# Altium schematic sheet Board.SchDoc
size 431 x 279 mm; Organization: Machine Intelligence Laboratory; Address1: 1889 Museum Rd; Address2: Room 3001; Address3: Gainesville, FL, 32611; SheetNumber: 1; SheetTotal: 1
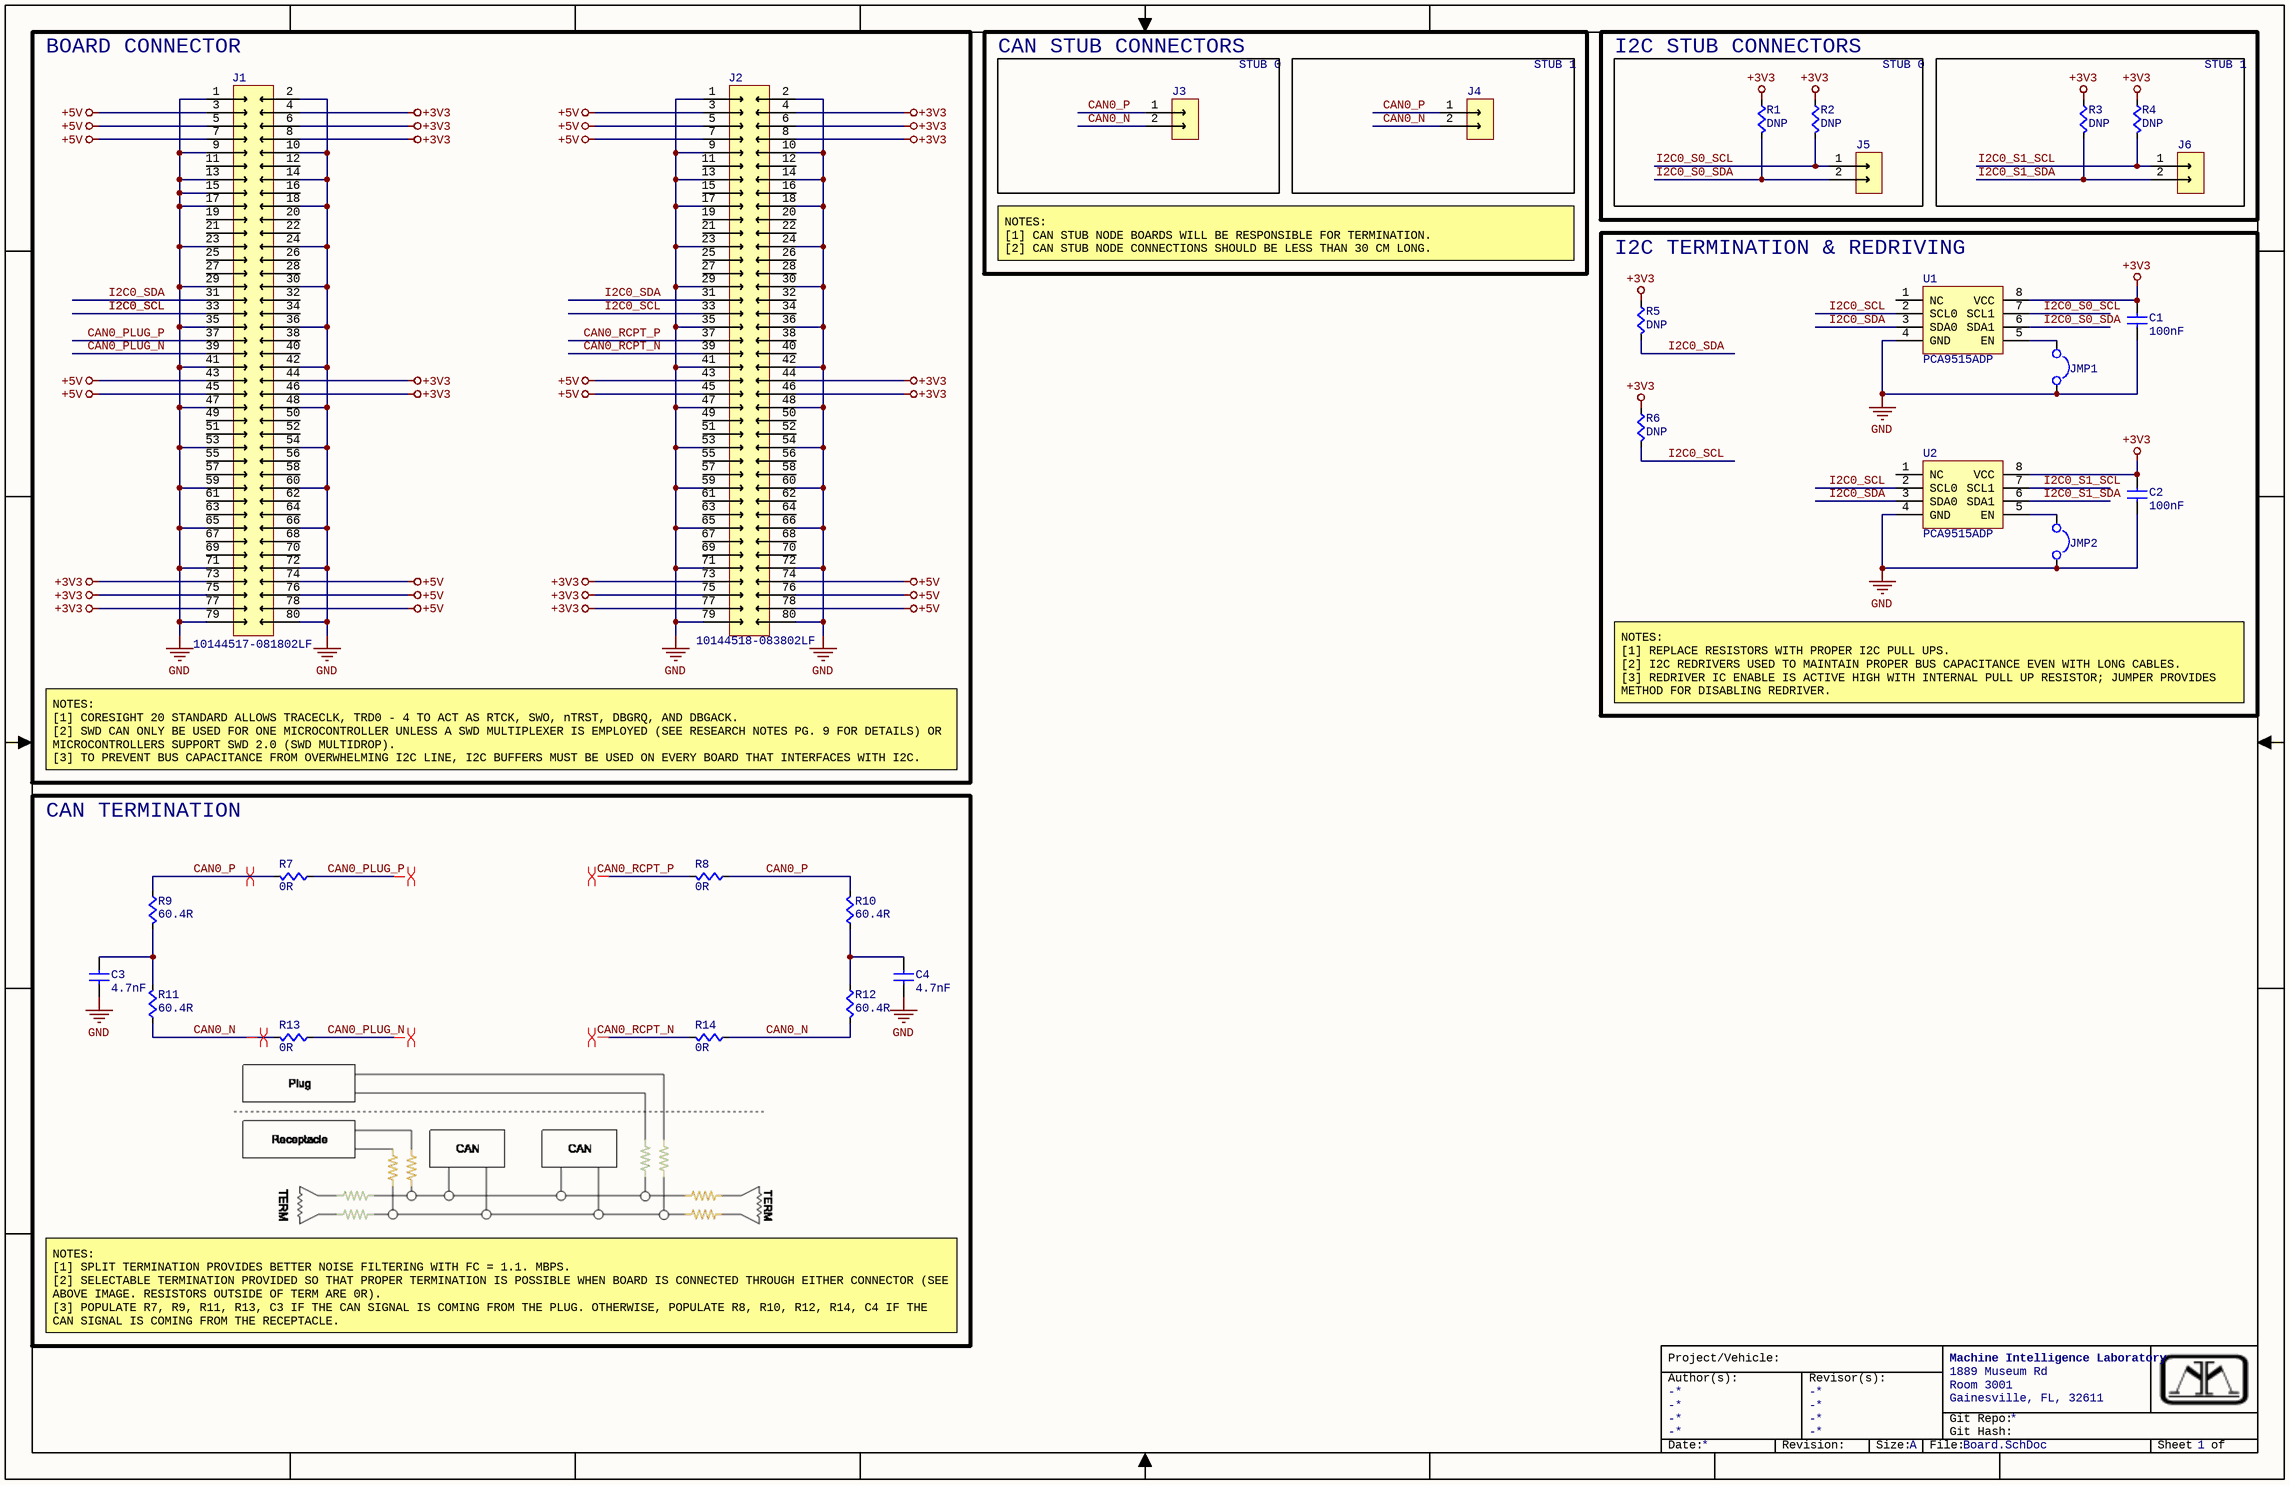
[diagram p0: Board.SchDoc]

## Parts
C1  100nF  [CAPC0603]
C2  100nF  [CAPC0603]
C3  4.7nF  [CAPC0603]
C4  4.7nF  [CAPC0603]
J1  10144517-081802LF  [AMPHENOL_10144517-081802LF]
J2  10144518-083802LF  [AMPHENOL_10144518-083802LF]
J3  0353630260  [MOLEX-HDR-1X2-SHERLOCK-HORZ]  (value not drawn)
J4  0353630260  [MOLEX-HDR-1X2-SHERLOCK-HORZ]  (value not drawn)
J5  0353630260  [MOLEX-HDR-1X2-SHERLOCK-HORZ]  (value not drawn)
J6  0353630260  [MOLEX-HDR-1X2-SHERLOCK-HORZ]  (value not drawn)
JMP1  2 Pin Header  [2PinJumper]  (value not drawn)  (no BOM)
JMP2  2 Pin Header  [2PinJumper]  (value not drawn)  (no BOM)
R1  DNP  [RES0603]
R2  DNP  [RES0603]
R3  DNP  [RES0603]
R4  DNP  [RES0603]
R5  DNP  [RES0603]
R6  DNP  [RES0603]
R7  0R  [RES0603]
R8  0R  [RES0603]
R9  60.4R  [RES0603]
R10  60.4R  [RES0603]
R11  60.4R  [RES0603]
R12  60.4R  [RES0603]
R13  0R  [RES0603]
R14  0R  [RES0603]
U1  PCA9515ADP  [SOP65P490X110-8N]
U2  PCA9515ADP  [SOP65P490X110-8N]

## Blocks framed on the sheet
BOARD CONNECTOR: J1 J2
CAN STUB CONNECTORS: J3
STUB 1: J4
I2C STUB CONNECTORS: J5 R1 R2
STUB 1: J6 R3 R4
I2C TERMINATION & REDRIVING: C1 C2 JMP1 JMP2 R5 R6 U1 U2
CAN TERMINATION: C3 C4 R7-R14

## Nets
+3V3: C1.2(B) C2.2(B) J1.4 J1.6 J1.8 J1.44 J1.46 J1.73 J1.75 J1.77 J2.4 J2.6 J2.8 J2.44 J2.46 J2.73 J2.75 J2.77 R1.2(B) R2.2(B) R3.2(B) R4.2(B) R5.2(B) R6.2(B) U1.8(VCC) U2.8(VCC)
+5V: J1.3 J1.5 J1.7 J1.43 J1.45 J1.74 J1.76 J1.78 J2.3 J2.5 J2.7 J2.43 J2.45 J2.74 J2.76 J2.78
GND: C1.1(A) C2.1(A) C3.2(B) C4.2(B) J1.1 J1.2 J1.9 J1.10 J1.13 J1.14 J1.15 J1.17 J1.18 J1.23 J1.24 J1.29 J1.30 J1.35 J1.36 J1.41 J1.42 J1.47 J1.48 J1.53 J1.54 J1.59 J1.60 J1.65 J1.66 J1.71 J1.72 J1.79 J1.80 J2.1 J2.2 J2.9 J2.10 J2.13 J2.14 J2.17 J2.18 J2.23 J2.24 J2.29 J2.30 J2.35 J2.36 J2.41 J2.42 J2.47 J2.48 J2.53 J2.54 J2.59 J2.60 J2.65 J2.66 J2.71 J2.72 J2.79 J2.80 JMP1.2 JMP2.2 U1.4(GND) U2.4(GND)
CAN0_N: J3.2 J4.2 R11.2(B) R12.2(B) R13.1(A) R14.2(B)
CAN0_P: J3.1 J4.1 R7.1(A) R8.2(B) R9.2(B) R10.2(B)
CAN0_PLUG_N: J1.39 R13.2(B)
CAN0_PLUG_P: J1.37 R7.2(B)
CAN0_RCPT_N: J2.39 R14.1(A)
CAN0_RCPT_P: J2.37 R8.1(A)
I2C0_S0_SCL: J5.1 R2.1(A) U1.7(SCL1)
I2C0_S0_SDA: J5.2 R1.1(A) U1.6(SDA1)
I2C0_S1_SCL: J6.1 R4.1(A) U2.7(SCL1)
I2C0_S1_SDA: J6.2 R3.1(A) U2.6(SDA1)
I2C0_SCL: J1.33 J2.33 R6.1(A) U1.2(SCL0) U2.2(SCL0)
I2C0_SDA: J1.31 J2.31 R5.1(A) U1.3(SDA0) U2.3(SDA0)
NetC3_1: C3.1(A) R9.1(A) R11.1(A)
NetC4_1: C4.1(A) R10.1(A) R12.1(A)
NetJMP1_1: JMP1.1 U1.5(EN)
NetJMP2_1: JMP2.1 U2.5(EN)

Not connected (* = marked no-connect by the designer): J1 11 12 16 19 20 21 22 25 26 27 28 32 34 38 40 49 50 51 52 55 56 57 58 61 62 63 64 67 68 69 70; J2 11 12 15 16 19 20 21 22 25 26 27 28 32 34 38 40 49 50 51 52 55 56 57 58 61 62 63 64 67 68 69 70; U1 1(NC); U2 1(NC)

## Layout directives
differential pair; rule Matched Net Lengths [Tolerance = 5mil]; rule Differential Pairs Routing [Pref Gap = 6mil    Min Gap  = 6mil    Max Gap  = 6milPref Width = 8mil    Min Width  = 5mil    Max Width  = 10mil]; net class CAN0; differential pair class CAN0_LINES: CAN0_N, CAN0_P
differential pair; rule Matched Net Lengths [Tolerance = 5mil]; rule Differential Pairs Routing [Pref Gap = 6mil    Min Gap  = 6mil    Max Gap  = 6milPref Width = 8mil    Min Width  = 5mil    Max Width  = 10mil]; net class CAN0_PLUG; differential pair class CAN0_LINES: CAN0_PLUG_N, CAN0_PLUG_P
differential pair; rule Matched Net Lengths [Tolerance = 5mil]; rule Differential Pairs Routing [Pref Gap = 6mil    Min Gap  = 6mil    Max Gap  = 6milPref Width = 8mil    Min Width  = 5mil    Max Width  = 10mil]; net class CAN0_RCPT; differential pair class CAN0_LINES: CAN0_RCPT_N, CAN0_RCPT_P

## Notes on the sheet
- STUB 0
- NOTES:
  [1] CAN STUB NODE BOARDS WILL BE RESPONSIBLE FOR TERMINATION.
  [2] CAN STUB NODE CONNECTIONS SHOULD BE LESS THAN 30 CM LONG.
- NOTES:
  [1] REPLACE RESISTORS WITH PROPER I2C PULL UPS.
  [2] I2C REDRIVERS USED TO MAINTAIN PROPER BUS CAPACITANCE EVEN WITH LONG CABLES.
  [3] REDRIVER IC ENABLE IS ACTIVE HIGH WITH INTERNAL PULL UP RESISTOR; JUMPER PROVIDES METHOD FOR DISABLING REDRIVER.
- NOTES:
  [1] CORESIGHT 20 STANDARD ALLOWS TRACECLK, TRD0 - 4 TO ACT AS RTCK, SWO, nTRST, DBGRQ, AND DBGACK.
  [2] SWD CAN ONLY BE USED FOR ONE MICROCONTROLLER UNLESS A SWD MULTIPLEXER IS EMPLOYED (SEE RESEARCH NOTES PG. 9 FOR DETAILS) OR MICROCONTROLLERS SUPPORT SWD 2.0 (SWD MULTIDROP).
  [3] TO PREVENT BUS CAPACITANCE FROM OVERWHELMING I2C LINE, I2C BUFFERS MUST BE USED ON EVERY BOARD THAT INTERFACES WITH I2C.
- NOTES:
  [1] SPLIT TERMINATION PROVIDES BETTER NOISE FILTERING WITH FC = 1.1. MBPS.
  [2] SELECTABLE TERMINATION PROVIDED SO THAT PROPER TERMINATION IS POSSIBLE WHEN BOARD IS CONNECTED THROUGH EITHER CONNECTOR (SEE ABOVE IMAGE. RESISTORS OUTSIDE OF TERM ARE 0R).
  [3] POPULATE R7, R9, R11, R13, C3 IF THE CAN SIGNAL IS COMING FROM THE PLUG. OTHERWISE, POPULATE R8, R10, R12, R14, C4 IF THE CAN SIGNAL IS COMING FROM THE RECEPTACLE.
- Project/Vehicle:
- Author(s):
- -
- Revisor(s):
- Git Repo:
- Git Hash:
- Date:
- Revision:
- Size:
- A
- File:
- Sheet
- of

## Library data of the parts
C1 C2 = CC0603KRX7R7BB104: Ceramic Capacitor, Multilayer, Cera; Manufacturer: Yageo; Multilayer: Yes; Tolerance  (fill in as +-): 10%; Rated DC Voltage (URdc): 16V; Temperature Characteristics Code: X7R; Part Number: CC0603KRX7R7BB104; Category: Ceramic Capacitors; Stock 1: 11347706; Pricing 1: 1=0.1, 10=0.042, 50=0.0238, 100=0.0; Mounting Technology: Surface Mount; Pins: 2; Package Shape: Rectangular; Case/Package: 0603; Terminal Finish: Nickel; Min Operating Temperature: -55°C; Max Operating Temperature: 125°C; JESD-609 Code: e3; Packaging: Tape and Reel; Value: 100nF; Termination: Wraparound; Reach SVHC Compliant: Yes; RoHS Compliant: Yes; ComponentLink1URL: https://datasheet.ciiva.com:443/pdf; ComponentLink1Description: https://datasheet.ciiva.com:443/pdf; ComponentLink2URL: https://datasheet.ciiva.com/11786/0; ComponentLink2Description: https://datasheet.ciiva.com/11786/0; ComponentLink3URL: https://datasheet.ciiva.com/8033/70; ComponentLink3Description: https://datasheet.ciiva.com/8033/70; ComponentLink4URL: https://datasheet.ciiva.com/7978/14; ComponentLink4Description: https://datasheet.ciiva.com/7978/14; ComponentLink5URL: https://datasheet.ciiva.com/28450/1; ComponentLink5Description: https://datasheet.ciiva.com/28450/1; ComponentLink6URL: https://datasheet.ciiva.com/46430/1; ComponentLink6Description: https://datasheet.ciiva.com/46430/1; ComponentLink7URL: https://datasheet.ciiva.com/144/mlc; ComponentLink7Description: https://datasheet.ciiva.com/144/mlc; ComponentLink8URL: https://datasheet.ciiva.com/144/mlc; ComponentLink8Description: https://datasheet.ciiva.com/144/mlc; ComponentLink9URL: https://datasheet.ciiva.com/144/mlc; ComponentLink9Description: https://datasheet.ciiva.com/144/mlc; Supplier Part Number 1: 311-1088-1-ND; Manufacturer Part Number: CC0603KRX7R7BB104; RoHS: Yes; Package Style: SMTMeter; Supplier 1: Digikey; Dielectric Material: Ceramic; Capacitor Type: Ceramic; Tolerance (fill in as +-): 10%; Length: 1.6mm; Width: 0.8mm; Height: 0.8mm; ComponentLink10URL: https://datasheet.ciiva.com/8033/17; ComponentLink10Description: https://datasheet.ciiva.com/8033/17; ComponentLink11URL: https://datasheet.ciiva.com/13395/u; ComponentLink11Description: https://datasheet.ciiva.com/13395/u; ComponentLink12URL: https://datasheet.ciiva.com/11464/u; ComponentLink12Description: https://datasheet.ciiva.com/11464/u; ComponentLink13URL: https://datasheet.ciiva.com/15165/g; ComponentLink13Description: https://datasheet.ciiva.com/15165/g; ComponentLink14URL: https://datasheet.ciiva.com:443/pdfs/VipMasterIC/IC/YAGO/YAGO-S-A0003557223; ComponentLink14Description: https://datasheet.ciiva.com:443/pdfs/VipMasterIC/IC/YAGO/YAGO-S-A0003557223; ComponentLink15URL: https://datasheet.ciiva.com/11786/0900766b80d84f1d-11786077.pdf?src-supplie; ComponentLink15Description: https://datasheet.ciiva.com/11786/0900766b80d84f1d-11786077.pdf?src-supplie; ComponentLink16URL: https://datasheet.ciiva.com/8033/70765-8033799.pdf?src-supplier=Element14; ComponentLink16Description: https://datasheet.ciiva.com/8033/70765-8033799.pdf?src-supplier=Element14; ComponentLink17URL: https://datasheet.ciiva.com/7978/1489800-7978141.pdf?src-supplier=Element14; ComponentLink17Description: https://datasheet.ciiva.com/7978/1489800-7978141.pdf?src-supplier=Element14; ComponentLink18URL: https://datasheet.ciiva.com/28450/1489800-28450552.pdf?src-supplier=Element
C3 C4 = CC0603JPX7R9BB472: Ceramic Capacitor, Multilayer, Cera; Manufacturer: Yageo; Multilayer: Yes; Tolerance  (fill in as +-): 5%; Rated DC Voltage (URdc): 50V; Temperature Characteristics Code: X7R; Part Number: CC0603JPX7R9BB472; Category: Ceramic Capacitors; Stock 1: 59880; Pricing 1: 1=0.1, 10=0.069, 50=0.0398, 100=0.0; Mounting Technology: Surface Mount; Pins: 2; Package Shape: Rectangular; Case/Package: 0603; Terminal Finish: Nickel; Min Operating Temperature: -55°C; Max Operating Temperature: 125°C; JESD-609 Code: e3; Packaging: Tape and Reel; Value: 4.7nF; Termination: Wraparound; Reach SVHC Compliant: Yes; RoHS Compliant: Yes; ComponentLink1URL: https://datasheet.ciiva.com:443/pdf; ComponentLink1Description: https://datasheet.ciiva.com:443/pdf; ComponentLink2URL: http://www.mouser.com/ds/2/447/Yage; ComponentLink2Description: http://www.mouser.com/ds/2/447/Yage; Supplier Part Number 1: 13-CC0603JPX7R9BB472CT-ND; Manufacturer Part Number: CC0603JPX7R9BB472; RoHS: Yes; Package Style: SMTMeter; Supplier 1: Digikey; Dielectric Material: Ceramic; Capacitor Type: Ceramic; Tolerance (fill in as +-): 5%; Length: 1.6mm; Width: 0.8mm; Height: 0.8mm
J1 = 10144517-081802LF: CONN RCPT 1 80POS SMD GOLD; System: Connector; Supplier 1: Digikey; Supplier Part Number 1: 609-5437-1-ND
J2 = 10144518-083802LF: CONN PLUG 3 80POS SMD GOLD; System: Connector; Supplier 1: Digikey; Supplier Part Number 1: 609-5455-1-ND
J3-J6 = SHERLOCK-1x2-RA: Header, Molex, 2mm Pitch Sherlock Header, Single Row, Horizontal, 2 Circuits, Length 3.3mm,  0353630260; Manufacturer: Molex Inc; Manufacturer Part Number: 0353630260; Supplier Part Number 1: WM18931-ND; Supplier 1: Digi-Key
JMP1 JMP2 = Jumper_2Pin: 2 Position Jumper
R1-R6 = Resistor_DNP: (DO NOT PLACE) Resistor
R7 R8 R13 R14 = RC0603FR-070RL: Fixed Resistor, Metal Glaze/thick F; Power: 100mW; Rated Temperature: 70°C; Part Number: RC0603FR-070RL; Category: Chip SMD Resistors; Stock 1: 2895000; Pricing 1: 5000=0.0015, 50000=0.0014, 125000=0; Mounting Technology: Surface Mount; Pins: 2; Package Shape: Rectangular; Case/Package: 0603; Terminal Finish: Nickel; Min Operating Temperature: -55°C; Max Operating Temperature: 155°C; JESD-609 Code: e3; Resistor Type: FIXED RESISTOR; Packaging: Tape and Reel; Value: 0R; Termination: Wraparound; Technology: METAL GLAZE/THICK FILM; Reach SVHC Compliant: Yes; RoHS Compliant: Yes; ComponentLink1URL: https://datasheet.ciiva.com:443/pdf; ComponentLink1Description: https://datasheet.ciiva.com:443/pdf; ComponentLink2URL: https://datasheet.ciiva.com/11808/0; ComponentLink2Description: https://datasheet.ciiva.com/11808/0; ComponentLink3URL: https://datasheet.ciiva.com/5684/44; ComponentLink3Description: https://datasheet.ciiva.com/5684/44; ComponentLink4URL: https://datasheet.ciiva.com/7983/44; ComponentLink4Description: https://datasheet.ciiva.com/7983/44; ComponentLink5URL: https://datasheet.ciiva.com/22643/1; ComponentLink5Description: https://datasheet.ciiva.com/22643/1; ComponentLink6URL: https://datasheet.ciiva.com/46382/4; ComponentLink6Description: https://datasheet.ciiva.com/46382/4; ComponentLink7URL: https://datasheet.ciiva.com/29721/p; ComponentLink7Description: https://datasheet.ciiva.com/29721/p; ComponentLink8URL: https://datasheet.ciiva.com/29721/p; ComponentLink8Description: https://datasheet.ciiva.com/29721/p; ComponentLink9URL: https://datasheet.ciiva.com/5558/rc; ComponentLink9Description: https://datasheet.ciiva.com/5558/rc
R9-R12 = RC0603FR-0760R4L: Fixed Resistor, Metal Glaze/thick F; Manufacturer: Yageo; Power: 100mW; Rated Temperature: 70°C; Tolerance: 1%; Additional Feature: LASER TRIMMABLE; Temperature Coefficient: 100ppm/°C; Working Voltage: 75V; Package Height: 0.45mm; Package Length: 1.6mm; Package Width: 0.8mm; Part Number: RC0603FR-0760R4L; Category: Chip SMD Resistors; Stock 1: 181136; Pricing 1: 1=0.1, 10=0.019, 50=0.0112, 100=0.0; Mounting Technology: Surface Mount; Pins: 2; Package Shape: Rectangular; Case/Package: 0603; Terminal Finish: Nickel; Min Operating Temperature: -55°C; Max Operating Temperature: 155°C; JESD-609 Code: e3; Resistor Type: FIXED RESISTOR; Packaging: Tape and Reel; Value: 60.4R; Termination: Wraparound; Technology: METAL GLAZE/THICK FILM; Reach SVHC Compliant: Yes; RoHS Compliant: Yes; ComponentLink1URL: https://datasheet.ciiva.com:443/pdf; ComponentLink1Description: https://datasheet.ciiva.com:443/pdf; ComponentLink2URL: https://datasheet.ciiva.com/12558/r; ComponentLink2Description: https://datasheet.ciiva.com/12558/r; Supplier Part Number 1: 311-60.4HRCT-ND; Manufacturer Part Number: RC0603FR-0760R4L; RoHS: Yes; Construction: Chip; Package Style: SMTMeter; Supplier 1: Digikey
U1 U2 = PCA9515ADP: IC REDRIVER I2C 2CH 8TSSOP; Supplier 1: Digikey; Supplier Part Number 1: 568-1032-1-ND